# EAGLE board cs_v2.1 (EAGLE 9.6.1)
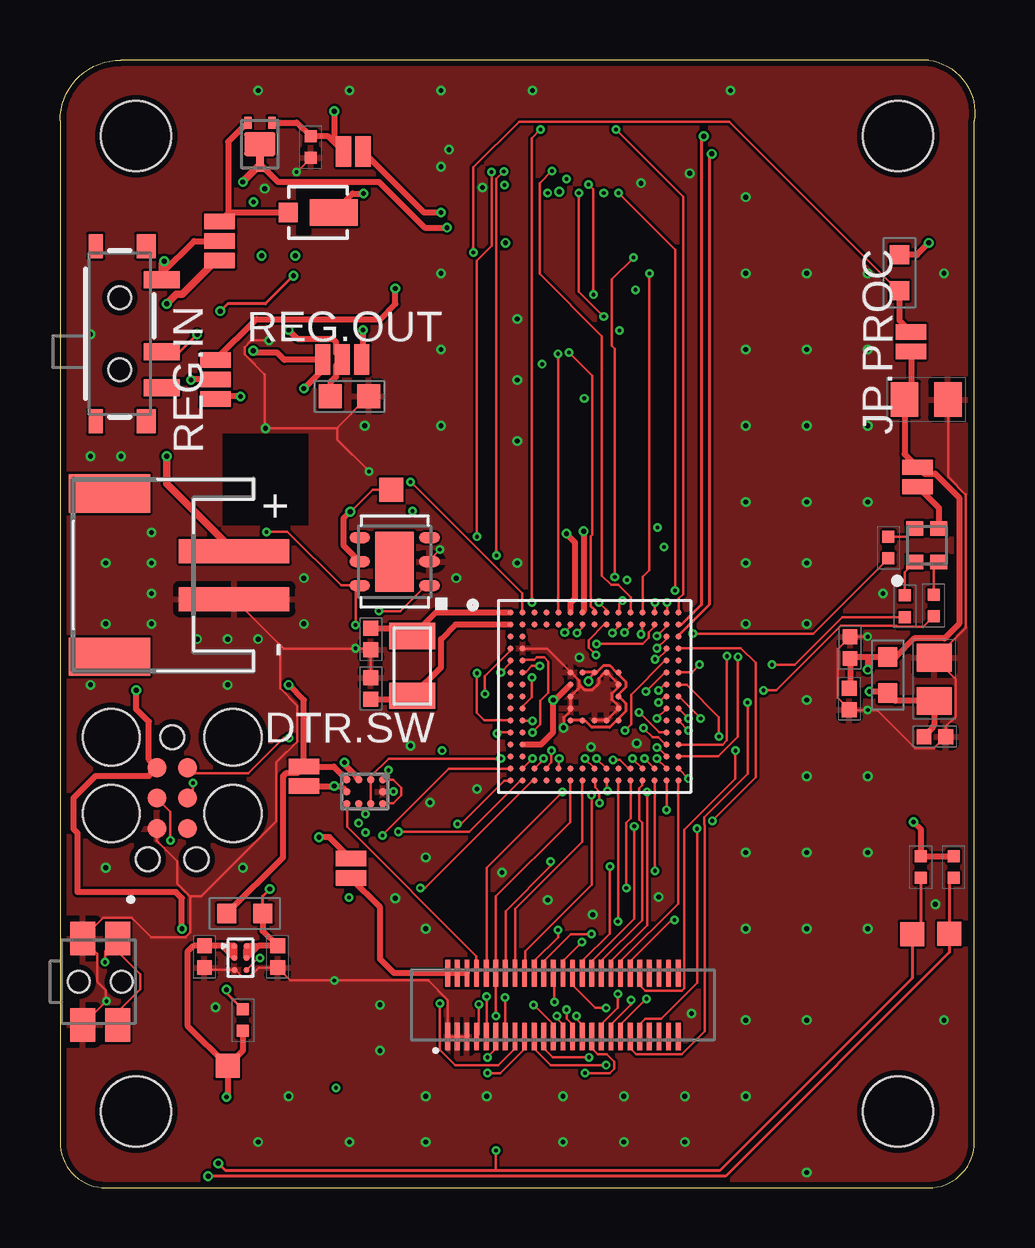
[diagram p11: board, top side]
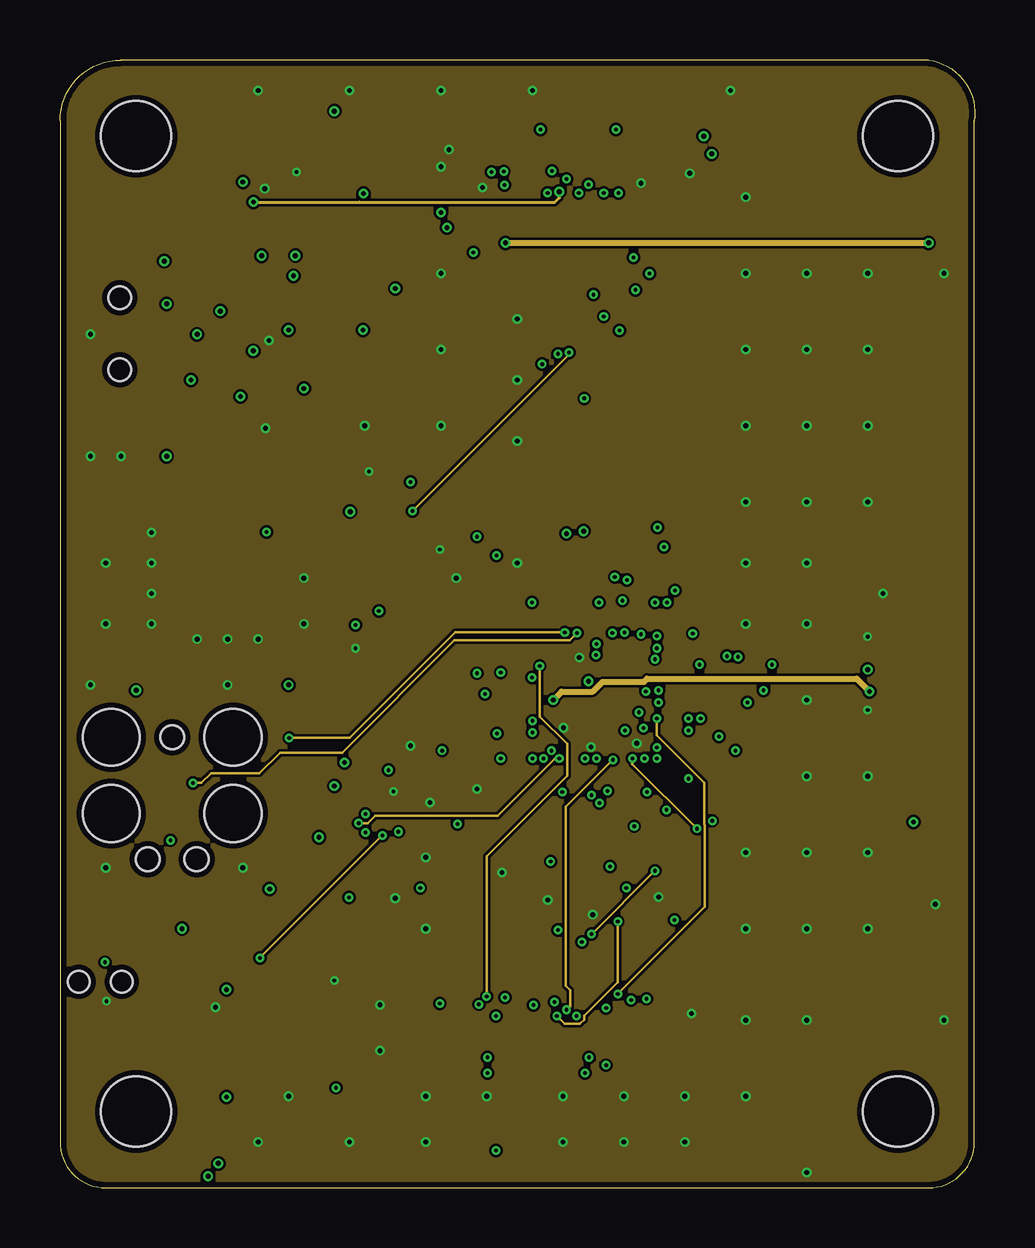
[diagram p12: board, inner layer Route2]
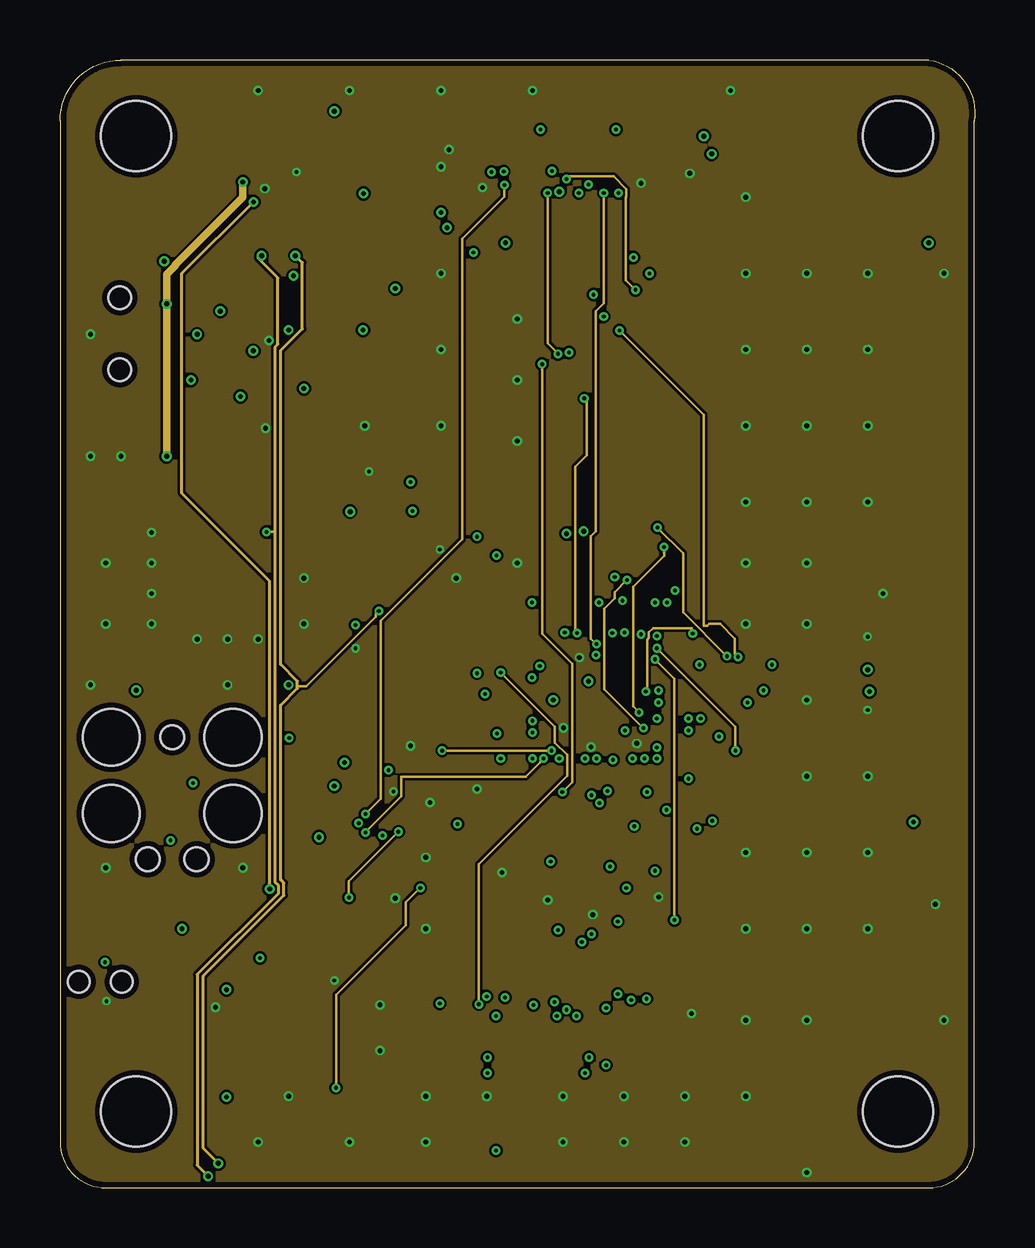
[diagram p13: board, inner layer Route15]
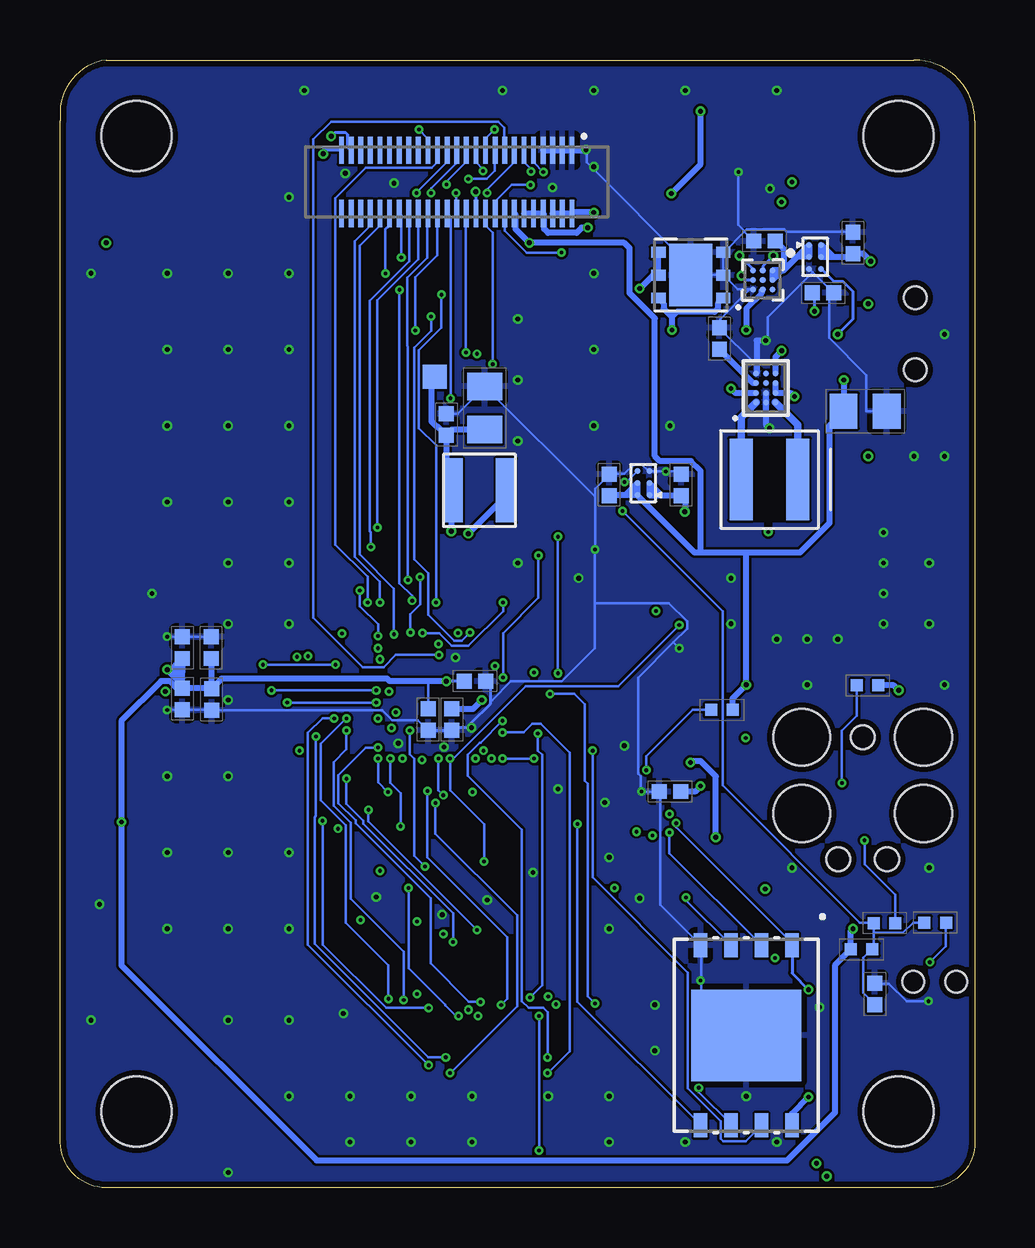
[diagram p14: board, bottom side, seen from below]

Size 38.12 x 46.99 mm. Coordinates in mm from the lower left corner, seen from the top.
Outline: 1.91,0 36.2,0 arc90 38.1,1.91 38.1,44.45 arc90 36.2,46.99 2.54,46.99 arc90 0,44.45 0,1.91 arc90 1.91,0
Copper layers (1+2*15+16): Top 0.001778125mm / dielectric 0.231140625mm / Route2 0.01778125mm / dielectric 0.929640625mm / Route15 0.01778125mm / dielectric 0.231140625mm / Bottom 0.01778125mm
Design rules "CSv2_bittele_4-layer *": minimum track width 4mil, minimum drill 6mil, track to track 4mil, track to pad 4mil, pad to pad 4mil, via to via 4mil, smd to smd 4mil, copper to edge 10mil, drill to drill 5mil, minimum pad ring 4mil, minimum via ring 4mil, stop-mask expansion 4mil, vias tented up to drill 0.25mm, thermal gap 10mil
Net classes: 1 power_3v3: width 0.254 mm; 5 10_mil: width 0.254 mm
Holes 2.92 mm at 3.17,3.17 34.92,3.17 34.92,43.81 3.17,43.81

## Footprints (pad centres in the part's own frame; a part is rotated, then mirrored left to right if it is on the bottom)
C0402 = smd 0.62 x 0.62: 1 -0.45,0; 2 0.45,0
C0805 = smd 1.15 x 1.45: 1 -0.9,0; 2 0.9,0
C0603 = smd 0.95 x 1: 1 -0.8,0; 2 0.8,0
TP10SQ = smd 1 x 1: TP 0,0
DIALIGHT_0606_598-8710-307F_0 = smd 0.6 x 0.7: 1 -0.7,0.5; 2 0.7,0.5; 3 -0.7,-0.5; 4 0.7,-0.5
SMT-JUMPER_2_NC_PASTE_NO-SILK = smd 0.635 x 1.27: 1 -0.406,0; 2 0.406,0
8.06.16_6-PIN_NEEDLE_ADAPTER_LEGS = smd 0.787 x 0.787: 1 -1.27,-0.635; 2 -1.27,0.635; 3 0,-0.635; 4 0,0.635; 5 1.27,-0.635; 6 1.27,0.635 | hole 0.991: -2.54,0; 2.54,1.015; 2.54,-1.015 | hole 2.375: -2.54,2.54; 0.635,2.54; 0.635,-2.54; -2.54,-2.54
JST-PH-2-SMT-RA = smd 1 x 4.6: 1 1,-3.7; 2 -1,-3.7 | smd 1.6 x 3.4: NC1 -3.4,1.5; NC2 3.4,1.5
HRS_DF40HC(4.0)-50DS-0.4V(51) = smd 0.2 x 1.14: 1 -4.8,-1.32; 2 -4.8,1.32; 3 -4.4,-1.32; 4 -4.4,1.32; 5 -4,-1.32; 6 -4,1.32; 7 -3.6,-1.32; 8 -3.6,1.32; 9 -3.2,-1.32; 10 -3.2,1.32; 11 -2.8,-1.32; 12 -2.8,1.32; 13 -2.4,-1.32; 14 -2.4,1.32; 15 -2,-1.32; 16 -2,1.32; 17 -1.6,-1.32; 18 -1.6,1.32; 19 -1.2,-1.32; 20 -1.2,1.32; 21 -0.8,-1.32; 22 -0.8,1.32; 23 -0.4,-1.32; 24 -0.4,1.32; 25 0,-1.32; 26 0,1.32; 27 0.4,-1.32; 28 0.4,1.32; 29 0.8,-1.32; 30 0.8,1.32; 31 1.2,-1.32; 32 1.2,1.32; 33 1.6,-1.32; 34 1.6,1.32; 35 2,-1.32; 36 2,1.32; 37 2.4,-1.32; 38 2.4,1.32; 39 2.8,-1.32; 40 2.8,1.32; 41 3.2,-1.32; 42 3.2,1.32; 43 3.6,-1.32; 44 3.6,1.32; 45 4,-1.32; 46 4,1.32; 47 4.4,-1.32; 48 4.4,1.32; 49 4.8,-1.32; 50 4.8,1.32
SMT-JUMPER_3_1-NC_PASTE_NO-SILK = smd 0.635 x 1.27: 1 -0.813,0; 2 0,0; 3 0.813,0
L1212 = smd 0.813 x 2.667: P$1 -1.1,0; P$2 1.1,0
L0603 = smd 0.8 x 0.8: 1 -0.75,0; 2 0.75,0
XAL40 = smd 0.965 x 3.404: 1 1.181,0; 2 -1.181,0
X2-DFN2015-3 = smd 0.309 x 0.5: 1 -0.5,-0.9; 2 0.5,-0.9 | smd 1.3 x 1: 3-1 0,0 | smd 0.309 x 0.65: 3-2 0,0.825
R0402 = smd 0.5 x 0.5: 1 -0.45,0; 2 0.45,0
R0603 = smd 0.8 x 0.8: 1 -0.75,0; 2 0.75,0
SW_EVQ-P7L01P = smd 1.4 x 1.05: 1_1 -1.8,0.725; 1_2 1.8,0.725; 2_1 -1.8,-0.725; 2_2 1.8,-0.725 | hole 0.9: 0,-0.9; 0,0.9
SWITCH_SPST_SMD_A = smd 0.7 x 1.5: 1 -2.25,-1.75; 2 -0.75,-1.75; 3 2.25,-1.75 | smd 1 x 0.6: GND1 -3.65,1; GND3 3.65,1 | smd 1 x 0.8: GND2 -3.65,-1.1; GND4 3.65,-1.1 | hole 0.95: -1.5,0; 1.5,0
UDFN6_NCP708] = smd 0.6 x 0.45: 1 -1.35,0.95; 2 -1.35,0; 3 -1.35,-0.95; 4 1.35,-0.95; 5 1.35,0; 6 1.35,0.95 | smd 1.8 x 2.6: 7 0,0
WSON-8_W15N = smd 1 x 0.55: 1 -3.746,1.905; 2 -3.746,0.635; 3 -3.746,-0.635; 4 -3.746,-1.905; 5 3.746,-1.905; 6 3.746,-0.635; 7 3.746,0.635; 8 3.746,1.905 | smd 3.81 x 4.572: 9 0,0
DSBGA10 = smd 0.305 x 0.305: A1 -0.5,0.75; A2 0,0.75; A3 0.5,0.75; B1 -0.5,0.25; B3 0.5,0.25; C1 -0.5,-0.25; C3 0.5,-0.25; D1 -0.5,-0.75; D2 0,-0.75; D3 0.5,-0.75
WLCSP6_2X3 = smd 0.254 x 0.254: A1 -0.25,0.5; A2 0.25,0.5; B1 -0.25,0; B2 0.25,0; C1 -0.25,-0.5; C2 0.25,-0.5
POWERDI323 = smd 2 x 1.1: 1 -1.25,0 | smd 0.8 x 0.8: 2 0.65,0
TFBGA120 = smd 0.25 x 0.25: GNDANA0 -1,0; GNDIO0 -3,2; GNDIO1 -1,-0.5; GNDIO2 0,-1; GNDIO3 0.5,-1; GNDIO4 1,-0.5; GNDIO5 1,0.5; GNDIO6 0.5,1; GNDIO7 -1,1; NRESET 0,3.5; PA00 -3.5,3.5; PA01 -3.5,3; PA02 -3.5,1.5; PA03 -3,1; PA04 -3,-1; PA05 -3.5,-1.5; PA06 -3,-1.5; PA07 -3.5,-2; PA08 -3.5,-3.5; PA09 -2.5,-3; PA10 -3,-3.5; PA11 -2,-3; PA12 2,-3.5; PA13 2.5,-3; PA14 2.5,-3.5; PA15 3,-3.5; PA16 3.5,-3.5; PA17 3,-3; PA18 3.5,-3; PA19 3,-2.5; PA20 3,1.5; PA21 3.5,2; PA22 3,2; PA23 3,2.5; PA24 3.5,2.5; PA25 3.5,3; PA27 0,3; PA30 -0.5,3; PA31 -1,3; PB00 -2.5,3.5; PB01 -2.5,3; PB02 -3,3.5; PB03 -3,3; PB04 -3.5,1; PB05 -3.5,0.5; PB06 -3,0; PB07 -3.5,-0.5; PB08 -3,-0.5; PB09 -3.5,-1; PB10 -2.5,-3.5; PB11 -1.5,-3; PB12 -2,-3.5; PB13 -1,-3; PB14 -1.5,-3.5; PB15 -0.5,-3; PB16 3.5,0; PB17 3.5,0.5; PB18 3,0.5; PB19 3.5,1; PB20 3,1; PB21 3.5,1.5; PB22 3.5,3.5; PB23 3,3.5; PB24 3,3; PB25 2.5,3; PB26 2.5,3.5; PB27 2,3; PB28 2,3.5; PB29 1.5,3; PB30 -1.5,3.5; PB31 -1.5,3; PC00 -3.5,2.5; PC01 -3,2.5; PC02 -3.5,2; PC03 -3,1.5; PC04 -3.5,-2.5; PC05 -3,-2.5; PC06 -3.5,-3; PC07 -3,-3; PC10 1,-3; PC11 0.5,-3.5; PC12 1,-3.5; PC13 1.5,-3; PC14 1.5,-3.5; PC15 2,-3; PC16 3.5,-2.5; PC17 3,-2; PC18 3.5,-2; PC19 3,-1.5; PC20 3.5,-1.5; PC21 3,-1; PC22 3.5,-1; PC23 3,-0.5; PC24 1.5,3.5; PC25 1,3; PC26 1,3.5; PC27 0.5,3.5; PC28 0.5,3; PC30 -2,3.5; PC31 -2,3; PD00 -3,0.5; PD01 -3.5,0; PD08 -1,-3.5; PD09 0,-3; PD10 -0.5,-3.5; PD11 0.5,-3; PD12 0,-3.5; PD20 3.5,-0.5; PD21 3,0; VDDANA0 -1,0.5; VDDANA1 -3,-2; VDDCORE -0.5,3.5; VDDIO3 1,-1; VDDIO4 1,0; VDDIO5 1,1; VDDIO6 0,1; VDDIO7 -0.5,1; VDDIOB1 -1,-1; VDDIOB2 -0.5,-1; VSW -1,3.5
BGA9N40P3X3_144X146X69N = smd 0.24 x 0.24: A1 -0.4,0.4; A2 0,0.4; A3 0.4,0.4; B1 -0.4,0; B2 0,0; B3 0.4,0; C1 -0.4,-0.4; C2 0,-0.4; C3 0.4,-0.4
12-WLP = smd 0.244 x 0.244: A1 -0.6,0.4; A2 -0.2,0.4; A3 0.2,0.4; A4 0.6,0.4; B1 -0.6,0; B2 -0.2,0; B3 0.2,0; B4 0.6,0; C1 -0.6,-0.4; C2 -0.2,-0.4; C3 0.2,-0.4; C4 0.6,-0.4
DFN-06 = smd 0.85 x 0.45: 1 -1.45,1; 2 -1.45,0; 3 -1.45,-1; 4 1.45,-1; 5 1.45,0; 6 1.45,1 | smd 1.6 x 2.5: 7 0,0
XTAL320X150X90 = smd 1.092 x 1.905: 1 -1.245,0; 2 1.245,0

## Placement (x,y rotation side)
C1  0.1u  [C0402]  12.7,16.51 180 bottom
C2  1u  [C0402]  5.08,39.37 90 bottom
C101  0.1u  [C0402]  4.17,8.08 90 bottom
C102  0.1u  [C0402]  32.92,22.5 90 top
C103  0.1u  [C0402]  22.02,31.8 90 bottom
C104  0.1u  [C0402]  33.02,22.5 90 bottom
C105  0.1u  [C0402]  21.79,19.51 270 bottom
C106  0.1u  [C0402]  33.02,20.37 270 bottom
C107  4.7u  [C0805]  20.42,32.49 90 bottom
C108  0.1u  [C0402]  36.45,18.8 0 top
C109  0.1u  [C0402]  32.89,20.37 270 top
C110  10u  [C0805]  36.42,21.18 90 top
C111  0.1u  [C0402]  22.78,19.51 270 bottom
C112  0.1u  [C0402]  31.8,20.35 270 bottom
C113  0.1u  [C0402]  20.83,21.11 0 bottom
C114  1u  [C0402]  31.83,22.5 90 bottom
C115  10u  [C0805]  36.09,32.84 0 top
C118  10p  [C0402]  12.95,22.86 270 top
C119  10p  [C0402]  12.95,20.8 90 top
C201  100n  [C0402]  8.76,39.45 180 bottom
C202  10u  [C0603]  12.06,32.97 0 top
C203  470n  [C0402]  6.32,37.29 0 bottom
C204  1u  [C0402]  10.64,35.38 90 bottom
C205  22u  [C0805]  4.57,32.36 0 bottom
C206  1u  [C0402]  9.07,9.63 270 top
C207  1u  [C0402]  15.24,29.29 90 bottom
C208  0.1u  [C0402]  6.02,9.63 270 top
C209  0.1u  [C0402]  12.24,29.29 90 bottom
CPU  PTR1TP10SQ  [TP10SQ]  22.5,33.78 180 bottom
D202  DIALIGHT_RGBLED_598-8710-307FDIALIGHT_598-8710-307F_0_0  [DIALIGHT_0606_598-8710-307F_0]  36.12,26.77 90 top
DTR.SW  JUMPER-SMT_2_NC_PASTE_NO-SILK  [SMT-JUMPER_2_NC_PASTE_NO-SILK]  10.16,17.14 90 top
J101  J-JTAG-CORTEX-NEEDLE6-LEGS  [8.06.16_6-PIN_NEEDLE_ADAPTER_LEGS]  4.67,16.23 270 top
J201  [JST-PH-2-SMT-RA]  3.56,25.53 90 top
J301  HIROSE-DF40_50-PIN_CONNECTORS-RECEPTACLE  [HRS_DF40HC(4.0)-50DS-0.4V(51)]  20.95,7.62 0 top
J302  HIROSE-DF40_50-PIN_CONNECTORS-RECEPTACLE  [HRS_DF40HC(4.0)-50DS-0.4V(51)]  21.59,41.91 180 bottom
JP201  JUMPER-SMT_2_NC_PASTE_NO-SILK  [SMT-JUMPER_2_NC_PASTE_NO-SILK]  12.22,43.18 0 top
JP202  JUMPER-SMT_2_NC_PASTE_NO-SILK  [SMT-JUMPER_2_NC_PASTE_NO-SILK]  35.74,29.62 90 top
JP203  JUMPER-SMT_3_1-NC_PASTE_NO-SILK  [SMT-JUMPER_3_1-NC_PASTE_NO-SILK]  6.65,39.45 90 top
JP205  JUMPER-SMT_2_NC_PASTE_NO-SILK  [SMT-JUMPER_2_NC_PASTE_NO-SILK]  12.12,13.31 90 top
JP.PROC  JUMPER-SMT_2_NC_PASTE_NO-SILK  [SMT-JUMPER_2_NC_PASTE_NO-SILK]  35.46,35.26 90 top
L101  L1212  [L1212]  20.65,29.06 180 bottom
L102  L0603  [L0603]  34.49,21.36 90 top
L201  1u  [XAL40]  8.56,29.51 0 bottom
Q1  DMG3415UFY4Q-7F  [X2-DFN2015-3]  8.33,43.48 180 top
R1  510k  [R0402]  10.44,43.36 90 top
R3  100k  [R0402]  7.62,6.99 90 top
R101  10k  [R0402]  4.72,9.93 180 bottom
R102  330  [R0402]  1.65,11.05 0 bottom
R103  4.7k  [R0402]  37.24,13.36 90 top
R104  4.7k  [R0402]  35.86,13.36 90 top
R105  39  [R0402]  3.76,11.02 0 bottom
R106  1k  [R0402]  4.47,20.93 0 bottom
R202  590  [R0402]  36.4,24.26 270 top
R203  590  [R0402]  35.2,24.23 270 top
R204  1k  [R0402]  34.52,26.67 270 top
R206  2.21  [R0603]  34.98,38.13 270 top
R207  0.24  [R0402]  10.54,19.91 180 bottom
R208  1  [R0603]  7.7,11.43 0 top
REG.IN  JUMPER-SMT_3_1-NC_PASTE_NO-SILK  [SMT-JUMPER_3_1-NC_PASTE_NO-SILK]  6.48,33.68 90 top
REG.OUT  JUMPER-SMT_3_1-NC_PASTE_NO-SILK  [SMT-JUMPER_3_1-NC_PASTE_NO-SILK]  11.76,34.52 0 top
S101  SW_EVQ-P7L01P_SPST_RA  [SW_EVQ-P7L01P]  1.68,8.59 270 top
S201  [SWITCH_SPST_SMD_A]  2.49,35.59 90 top
SCL  PTR1TP10SQ  [TP10SQ]  37.06,10.59 90 top
SDA  PTR1TP10SQ  [TP10SQ]  35.51,10.57 90 top
STOR  PTR1TP10SQ  [TP10SQ]  6.99,5.08 180 top
TEMP  PTR1TP10SQ  [TP10SQ]  13.79,29.08 270 top
U1  NCP708MU330TAG  [UDFN6_NCP708]]  11.84,38.02 180 bottom
U2  W25N01GVZEIG  [WSON-8_W15N]  9.53,6.35 270 bottom
U3  TS3A24159YZPR  [DSBGA10]  12.7,16.51 270 top
U4  LOADSWITCH-MIC94164  [WLCSP6_2X3]  6.65,38.79 0 bottom
U5  PD3S140-7  [POWERDI323]  10.16,40.64 180 top
U101  ATSAMD51  [TFBGA120]  22.28,20.47 0 top
U201  COULOMB-MAX17262  [BGA9N40P3X3_144X146X69N]  8.84,37.82 270 bottom
U202  MAX77827BEWC+T  [12-WLP]  8.71,33.32 90 bottom
U203  SENSOR-SI7006  [DFN-06]  13.94,26.09 180 top
U204  LOADSWITCH-MIC94164  [WLCSP6_2X3]  7.52,9.58 0 top
U205  LOADSWITCH-MIC94164  [WLCSP6_2X3]  13.82,29.36 180 bottom
Y102  ABS07-32.768KHZ-9-T  [XTAL320X150X90]  14.68,21.74 270 top

## Tracks (layer width: path | path; a pad name or v marks a point on that pad's centre or on a via)
+3V3  (via drill 0.2)
  Top 0.254: REG.IN.2 5.49,33.68 v5.46,33.66 | v36.2,39.37 35.7,38.88 R206.1 | DTR.SW.2 11.41,17.55 U3.D1 | DTR.SW.2 9.89,17.29 9.43,17.29 9.3,17.15 9.3,13.78 R208.1 | DTR.SW.2 10.16,20.32 v9.53,20.95
  Route2 0.254: v18.56,39.37 v36.2,39.37
  Bottom 0.254: v5.46,33.66 5.47,33.64 C205.1 6.06,31.77 6.06,27.69 7.29,26.47 9.53,26.47 | U205.A2 14.28,28.86 | 14.28,28.86 14.57,28.86 | 14.57,28.86 15.21,28.86 C207.1 | U205.B2 U205.A2 | U205.B2 14.57,28.86 | U205.B2 14.28,29.16 14.28,28.86 | J302.14 19.15,40.55 19.15,39.95 v18.56,39.37 14.61,39.37 14.4,39.16 14.4,37.29 13.34,36.22 13.34,30.48 13.13,30.27 11.84,30.27 11.43,29.87 11.43,26.47 | U205.A2 13.92,28.72 13.92,28.71 11.68,26.47 11.43,26.47 | 9.53,26.47 11.43,26.47 | 9.53,26.47 v9.53,20.95 10.09,20.39 R207.1
+3V3_DTR
  Top 0.254: J301.6 J301.4 J301.2 13.92,8.94 13.34,9.53 13.34,11.68 JP205.1
+3V3_DTR.SW  (via drill 0.2)
  Top 0.254: JP205.2 11.23,14.61 v10.79,14.61 | U3.C1 12.33,17.13 12.33,17.17 11.85,17.65 v11.85,17.72
  Bottom 0.254: v10.79,14.61 10.79,17.14 11.43,17.78 11.79,17.78 v11.85,17.72
+3V3_DTR_SENSE-  (via drill 0.15)
  Top 0.102: 13.69,16.99 13.46,16.99 U3.A1 | 13.69,16.99 13.89,16.99 14.22,16.66 14.22,16.36 13.89,16.03 13.46,16.03 U3.A3 | 13.69,16.99 v13.69,17.4
  Bottom 0.102: R207.2 11.76,19.91 13.69,17.98 v13.69,17.4
+3V3_PROC  (via drill 0.2)
  Top 0.127: v22.02,21.11 22.02,21.22 U101.VDDIO6 | U101.VDDIO6 U101.VDDIO7 | U101.VDDIO6 22.37,21.47 22.66,21.76 22.9,21.76 23.19,21.47 U101.VDDIO5 23.28,21.39 23.57,21.09 23.57,20.85 23.28,20.56 U101.VDDIO4 23.57,20.18 23.57,19.85 23.28,19.56 U101.VDDIO3 23.19,19.47 22.9,19.18 22.16,19.18 21.87,19.47 U101.VDDIOB2 U101.VDDIOB1
  Top 0.254: JP.PROC.1 35.46,33.11 C115.1 35.19,30.57 JP202.2 36.01,29.76 36.47,29.76 37.47,28.76 37.47,23.5 36.86,22.89 35.6,22.89 34.83,22.11 L102.2 33.66,22.11 | 33.66,22.11 32.98,22.11 C102.1 32.92,20.85 C109.1 | 33.66,22.11 v33.66,21.59 | v35.56,15.24 35.87,14.94 R104.2 R103.2 | v5.08,10.79 5.08,12.06 4.83,12.32 0.74,12.32 0.74,14.77 0.56,14.95 0.56,16.25 1.48,17.16 3.7,17.16 J101.1 3.7,17.84 3.7,19.42 3.17,19.95 v3.17,20.73 | U101.VDDIO5 | U101.VDDIO5 | U101.VDDIO3
  Bottom 0.102: 22.78,21.11 C111.1
  Bottom 0.127: C113.1 v22.02,21.11
  Bottom 0.254: C104.1 33.3,21.77 33.02,21.49 | C104.1 33.02,21.49 | C106.1 33.02,21.01 | 33.02,21.01 33.02,21.23 | 33.02,21.23 33.02,21.49 | C104.1 33.48,21.59 v33.66,21.59 | v33.66,21.59 33.55,21.49 33.02,21.49 | v33.66,21.59 33.07,21.01 33.02,21.01 | v33.66,21.59 33.3,21.23 33.02,21.23 | C106.1 33.27,20.82 33.55,21.11 33.91,21.11 35.56,19.45 v35.56,15.24 35.56,9.27 27.43,1.14 7.82,1.14 5.83,3.13 5.83,9.27 R101.2 5.17,10.7 v5.08,10.79 | v3.17,20.73 3.38,20.93 R106.2 | 22.78,19.99 C111.1 | v22.02,21.11 22.78,21.11 24.38,21.11 24.49,21.21 31.39,21.21 C112.1 31.83,20.82 | C114.1 31.83,20.82 | 31.83,20.82 C106.1
+3V3_STOR  (via drill 0.2)
  Top 0.254: U204.A1 U204.B1 6.99,9.86 | 6.99,9.86 6.77,10.08 6.48,10.08 | 6.48,10.08 C208.1 5.55,10.08 5.31,9.83 5.31,6.76 STOR.TP | U204.A1 6.48,10.08 | U204.A1 7.05,9.86 6.99,9.86 | STOR.TP 6.99,3.83 v6.93,3.79 | R3.1 7.62,5.71 STOR.TP
  Bottom 0.254: U2.8 7.62,3.1 v6.93,3.79
+3V3_TEMP  (via drill 0.2)
  Top 0.102: TEMP.TP 13.03,29.08 12.19,28.25 v12.09,28.17
  Top 0.254: v12.09,28.17 11.81,27.89 11.81,26.77 U203.5
  Bottom 0.254: 13.18,28.86 U205.A1 U205.B1 | 13.18,28.86 13.07,28.86 | 13.07,28.86 12.27,28.86 C209.1 12.06,28.66 12.06,28.17 v12.09,28.17 | U205.B1 13.57,29.25 13.18,28.86 | U205.B1 13.07,28.86
+3V7_BATT  (via drill 0.2)
  Top 0.254: v16.13,40.01 15.19,40.01 13.28,41.91 9.08,41.91 Q1.3-2 Q1.3-1
  Top 0.305: J201.1 4.45,29.34 v4.45,30.48 | v7.62,41.91 8.33,42.62 Q1.3-2 | v4.45,36.83 4.85,37.23 5.09,37.23 6.5,38.63 JP203.1
  Route15 0.305: v7.62,41.91 7.62,41.27 4.8,38.45 4.8,38.42 4.45,38.06 v4.45,36.83 v4.45,30.48
  Bottom 0.254: v16.13,40.01 16.38,40.01 16.59,39.79 17.79,39.79 17.95,39.95 17.95,40.55 J302.8 J302.10 J302.12
BB_LX1
  Bottom 0.305: U202.A1 9.74,32.1 L201.2
BB_LX2
  Bottom 0.305: U202.C1 7.38,31.79 L201.1
BB_REG_OUT  (via drill 0.2)
  Top 0.254: v7.52,32.97 6.58,32.97 REG.IN.1
  Bottom 0.254: v7.52,32.97 7.67,33.12 U202.C2 U202.C3
CC_IN
  Bottom 0.254: 7.14,38.79 U4.B1 U4.A1 | 7.14,38.79 7.41,38.79 | U4.A1 7.14,39.05 7.14,38.79 | U4.A1 7.41,38.79 | 7.41,38.79 7.97,38.22 | 8.04,38.22 8.26,38.22 | 8.26,38.22 U201.A1 U201.A2 | C201.1 7.97,39.1 7.97,38.22 | U201.A2 8.26,38.01 8.26,38.22 | U201.A2 8.04,38.22 | 8.04,38.22 7.97,38.22
DBG_DTR0_V_SENSE  (via drill 0.15)
  Top 0.102: v12.72,15.57 12.47,15.82 12.47,16 U3.C3
  Route15 0.102: v12.72,15.57 13.36,16.2 13.36,23.62 16.76,27.03 16.76,39.55 18.52,41.3 v18.52,41.78
  Bottom 0.102: v18.52,41.78 19.3,41.78 19.99,41.1 19.99,40.62 J302.18
DBG_DTR1_V_SENSE  (via drill 0.15)
  Top 0.102: v20.93,16.48 17.78,13.34 17.78,8.94 J301.10
  Route15 0.102: v20.93,16.48 21.34,16.89 21.34,21.84 20.09,23.09 v20.09,34.31
  Bottom 0.102: v20.09,34.31 20.09,39.8 20.37,40.08 20.37,40.59 J302.20
DBG_GPIO0  (via drill 0.15)
  Top 0.102: v23.16,44.09 25.96,41.3 25.96,24.74 25.78,24.56 U101.PB22
  Bottom 0.102: v23.16,44.09 22.81,43.74 22.81,43.23 J302.31
DBG_GPIO1  (via drill 0.15)
  Top 0.102: v25.3,24.38 25.3,23.98 U101.PB23
  Bottom 0.102: v25.3,24.38 25.3,25.45 26.64,26.8 26.64,41.22 25.38,42.49 22.63,42.49 22.4,42.72 22.4,43.2 J302.29
DBG_GPIO2  (via drill 0.15)
  Top 0.102: v24.87,22.99 25.27,23.39 U101.PB24 | v25.63,24.89 25.63,39.09 v23.27,41.45
  Bottom 0.102: v24.87,22.99 24.87,23.47 25.63,24.23 v25.63,24.89 | v23.27,41.45 22,42.72 22,43.2 J302.27
DBG_GPIO3  (via drill 0.15)
  Top 0.102: v22.35,22.66 24.28,22.66 24.54,22.91 24.54,23.14 24.77,23.37 24.77,23.47 U101.PB25
  Route15 0.102: v22.35,22.66 22.12,22.89 22.12,27.15 22.33,27.36 22.33,36.52 22.66,36.85 v22.66,41.45
  Bottom 0.102: v22.66,41.45 22.66,41.66 21.61,42.7 21.61,43.2 J302.25
DBG_GPIO4/SERCOM6_P0  (via drill 0.15)
  Top 0.102: v28.25,22.12 28.25,18.8 27.43,17.98 25.78,17.98 U101.PC16
  Route15 0.102: v28.25,22.12 28.12,22.25 28.12,22.89 27.51,23.5 27.05,23.5 26.98,23.42 26.82,23.42 26.82,32.21 v23.32,35.71
  Bottom 0.102: v23.32,35.71 23.32,37.95 22.4,38.86 22.4,40.59 J302.30
DBG_GPIO5/SERCOM6_P1  (via drill 0.15)
  Top 0.102: v24.31,19.15 24.69,18.77 24.92,18.77 25.2,18.49 25.27,18.49 U101.PC17
  Route15 0.102: v24.31,19.15 22.68,20.78 22.68,24.13 23.11,24.56 23.11,24.82 v23.62,25.32
  Bottom 0.102: v23.62,25.32 23.62,35.05 23.65,35.08 23.65,37.92 22.81,38.76 22.81,40.59 J302.32
DBG_GPIO6/SERCOM6_P2  (via drill 0.15)
  Top 0.102: v27.79,22.15 27.79,18.64 27.61,18.47 U101.PC18
  Route15 0.102: v27.79,22.15 25.96,23.98 25.96,26.44 v24.89,27.51
  Bottom 0.102: v24.89,27.51 24.89,36.98 23.19,38.68 J302.34
DBG_GPIO7/SERCOM6_P3  (via drill 0.15)
  Top 0.102: v24.13,19.81 24.97,18.97 U101.PC19
  Route15 0.102: v24.13,19.81 23.88,20.07 23.88,25.04 25.17,26.34 v25.17,26.7
  Bottom 0.102: v25.17,26.7 25.17,27.3 25.22,27.36 25.22,36.96 23.57,38.61 23.57,40.59 J302.36
DBG_GPIO8  (via drill 0.15)
  Top 0.102: v24.79,24.38 U101.PB26
  Bottom 0.102: v24.79,24.38 24.79,25.25 25.83,26.29 25.83,39.45 25.2,40.08 J302.44
DBG_GPIO9  (via drill 0.15)
  Top 0.102: v24.21,23.06 24.26,23.11 24.26,23.47 U101.PB27
  Bottom 0.102: v24.21,23.06 24.21,24.97 25.63,26.39 25.63,39.24 24.79,40.08 J302.42
DBG_GPIO10  (via drill 0.15)
  Top 0.102: v24.56,38.1 24.56,25.73 24.28,25.45 U101.PB28
  Bottom 0.102: v24.56,38.1 24.56,39.93 24.41,40.08 24.41,40.59 J302.40
DBG_GPIO11  (via drill 0.15)
  Top 0.102: v23.52,23.14 23.77,23.39 U101.PB29 | v23.11,25.45 23.11,34.95 22.99,35.08 22.99,37.85 v23.9,38.76
  Bottom 0.102: v23.52,23.14 23.52,23.9 23.11,24.31 v23.11,25.45 | v23.9,38.76 23.9,40.51 23.98,40.59 J302.38
DBG_PROC_V_SENSE  (via drill 0.15)
  Top 0.102: v17.22,38.96 17.22,42.52 19.13,44.42 27.89,44.42 34.87,37.44 R206.2
  Top 0.254: R206.2 34.98,36.14 JP.PROC.2
  Bottom 0.102: v17.22,38.96 18.67,38.96 19.58,39.88 J302.16
DBG_SERIAL_RX_SERCOM4  (via drill 0.15)
  Top 0.102: v17.37,21.44 17.37,19.79 17.68,19.48 18.77,19.48 U101.PB09 | v17.37,27.13 17.37,38.63 17.98,39.24 v17.98,42.32
  Bottom 0.102: v17.37,27.13 v17.37,21.44 | v17.98,42.32 18.39,42.72 18.39,43.2 J302.9
DBG_SERIAL_TX_SERCOM4  (via drill 0.15)
  Top 0.102: v19.66,21.26 19.66,20.45 19.28,20.07 19.28,19.99 U101.PB08 | v18.19,26.34 18.19,42.04 v18.49,42.34
  Bottom 0.102: v19.66,21.26 19.66,23.11 18.19,24.59 v18.19,26.34 | v18.49,42.34 18.49,42.44 18.77,42.72 18.77,43.2 J302.11
DBG_STOR_V_SENSE  (via drill 0.2)
  Top 0.127: R208.2 8.45,12.15 v8.74,12.45
  Top 0.254: R208.2 8.45,10.7 C206.1 8.26,10.08 | 7.9,10.08 U204.A2 7.77,9.8 | 7.9,10.08 8.26,10.08 | 7.77,9.8 U204.B2 | U204.B2 7.98,9.8 | 8.26,10.08 7.98,9.8 | 7.98,9.8 7.77,9.8 | U204.B2 7.77,9.95 7.9,10.08
  Route2 0.127: v8.06,41.07 12.49,41.07 12.5,41.06 20.61,41.06 20.8,41.25 v20.8,41.5
  Route15 0.127: v8.74,12.45 8.74,25.27 5.08,28.93 5.08,38.1 v8.05,41.07 v8.06,41.07
  Bottom 0.127: J302.22 20.8,40.6 v20.8,41.5
DBG_SWCLK  (via drill 0.15)
  Top 0.102: v5.54,16.87 5.54,16.46 J101.4 | v21.54,23.11 21.77,23.34 21.77,23.47 U101.PA30
  Route2 0.102: v5.54,16.87 5.89,16.87 6.3,17.27 8.31,17.27 9.17,18.14 11.76,18.14 16.43,22.81 21.23,22.81 v21.54,23.11
  Route15 0.102: v21.54,23.11 21.46,23.19 21.46,30.05 21.95,30.53 21.95,32.79 v21.84,32.89
  Bottom 0.102: v5.54,16.87 5.54,19.05 4.93,19.66 R106.1 | v21.84,32.89 21.84,40.46 21.97,40.59 J302.28
DBG_SWDIO  (via drill 0.15)
  Top 0.102: v21.03,23.14 21.26,23.37 21.26,23.47 U101.PA31 | v9.55,18.75 9.32,18.75 7.85,17.27 5.54,17.27 J101.2 | v21.61,41.45 21.61,37.34 v22.66,36.3
  Route2 0.102: v21.03,23.14 16.46,23.14 12.06,18.75 v9.55,18.75
  Bottom 0.102: v21.61,41.45 21.61,40.62 J302.26 | v22.66,36.3 22.66,35.71 23.37,35 23.37,26.19 22.78,25.6 22.78,23.88 21.69,22.78 21.39,22.78 v21.03,23.14
DBG_TRACE_CLK/GPIO17  (via drill 0.15)
  Top 0.102: v22.45,24.38 22.76,24.08 22.76,23.98 U101.PC27 | v22.23,37.21 22.23,41.6 v22.02,41.81
  Bottom 0.102: v22.45,24.38 22.45,30.94 23.16,31.65 23.16,34.9 22.23,35.84 v22.23,37.21 | v22.02,41.81 22.02,41.91 21.21,42.72 21.21,43.2 J302.23
DBG_TRACE_D0/GPIO13  (via drill 0.15)
  Top 0.102: v22.33,22.2 22.02,22.5 22.02,22.81 22.68,23.47 22.76,23.47 U101.PC28
  Bottom 0.102: v22.33,22.2 24.13,22.2 24.64,21.69 25.5,21.69 27.56,23.75 27.56,43.69 26.82,44.42 19.86,44.42 19.61,44.17 19.61,43.23 J302.15
DBG_TRACE_D1/GPIO14  (via drill 0.15)
  Top 0.102: v23.44,24.46 23.29,24.31 23.29,23.98 U101.PC26
  Route15 0.102: v23.98,37.41 23.57,37.82 23.57,41.27 23.6,41.3 23.6,41.6 23.06,42.14 21.11,42.14 v21.11,42.04
  Bottom 0.102: v23.44,24.46 23.44,24.66 23.98,25.2 v23.98,37.41 | v21.11,42.04 20.34,42.04 20.02,42.37 20.02,43.2 J302.17
DBG_TRACE_D2/GPIO15  (via drill 0.15)
  Top 0.102: v23.01,23.11 23.27,23.37 23.27,23.47 U101.PC25 | v19.66,24.38 19.66,43.74 v20.02,44.09
  Bottom 0.102: v23.01,23.11 22.33,23.11 21.79,22.58 21.11,22.58 19.66,24.03 v19.66,24.38 | v20.02,44.09 20.37,43.74 20.37,43.23 J302.19
DBG_TRACE_D3/GPIO16  (via drill 0.15)
  Top 0.102: v20.5,42.37 19.99,41.86 19.99,38.08 22.58,35.48 22.58,25.5 22.96,25.12 23.27,25.12 23.77,24.61 U101.PC24
  Bottom 0.102: v20.5,42.37 20.5,42.44 20.78,42.72 20.78,43.2 J302.21
DBG_TRACE_SWO/GPIO12  (via drill 0.15)
  Top 0.102: v20.75,34.75 20.75,23.98 U101.PB30
  Route15 0.102: v20.75,34.75 20.32,35.18 v20.32,41.45
  Bottom 0.102: v20.32,41.45 20.32,41.6 19.2,42.72 19.2,43.2 J302.13
DBG_USB_D_N  (via drill 0.2)
  Top 0.127: v27.15,43.08 27.05,42.98 27.05,24.29 25.78,23.02 U101.PA24
  Bottom 0.127: J302.49 27.15,43.23 v27.15,43.08
DBG_USB_D_P  (via drill 0.2)
  Top 0.127: v26.82,43.81 26.72,43.71 26.72,24.29 25.9,23.47 U101.PA25
  Bottom 0.127: J302.47 26.12,43.37 26.12,43.87 26.22,43.97 26.67,43.97 v26.82,43.81
DBG_VDD  (via drill 0.2)
  Top 0.254: JP201.2 15.16,40.64 v15.88,40.64
  Bottom 0.254: v15.88,40.64 16.74,40.64 J302.2 J302.4 J302.6
DTR_BUS0_AIN0/GPIO2  (via drill 0.15)
  Top 0.102: v18.36,21.46 18.77,21.87 U101.PA02 | v17.45,7.64 17.45,6.4 17.37,6.33 J301.7
  Route15 0.102: v18.36,21.46 20.62,19.2 20.62,18.54 21.13,18.03 21.13,17.17 17.45,13.49 v17.45,7.64
DTR_BUS0_AIN1/GPIO3  (via drill 0.15)
  Top 0.102: v19.99,21.74 19.66,21.74 19.41,21.49 19.28,21.49 U101.PA03 | v17.78,7.98 17.78,6.33 J301.9
  Route2 0.102: v19.99,21.74 19.99,19.63 21.13,18.49 21.13,17.17 17.78,13.82 v17.78,7.98
DTR_BUS0_GPIO0/I2S_SCK0  (via drill 0.15)
  Top 0.102: v26.7,19.56 U101.PB16 | v22.76,5.11 20.45,5.11 19.76,5.79 J301.19
  Bottom 0.102: v26.7,19.56 27.18,19.56 27.79,18.95 27.79,10.13 v22.76,5.11
DTR_BUS0_GPIO1/I2S_MCK0  (via drill 0.15)
  Top 0.102: v27.46,18.8 27.46,19.61 26.11,20.95 25.78,20.95 U101.PB17 | v22.05,5.44 20.52,5.44 20.17,5.79 J301.21
  Bottom 0.102: v27.46,18.8 27.46,15.49 27.51,15.44 27.51,10.16 22.78,5.44 v22.05,5.44
DTR_BUS0_SERCOM5_P0/I2S_FS1  (via drill 0.15)
  Top 0.102: v24.87,22.48 25.27,22.89 U101.PA23 | v28.14,18.21 28.14,17.04 26.01,14.91 26.01,8.31 25.91,8.2 24.38,8.2 24.16,8.43 24.16,8.91 J301.42
  Route15 0.102: v24.87,22.48 28.14,19.2 v28.14,18.21
DTR_BUS0_SERCOM5_P1/I2S_SDI  (via drill 0.15)
  Top 0.102: v24.79,22.02 24.89,22.02 25.27,22.4 25.27,22.45 U101.PA22 | v25.6,11.15 25.48,11.15 23.77,9.45 23.77,8.94 J301.40
  Route15 0.102: v24.79,22.02 25.6,21.21 v25.6,11.15
DTR_BUS0_SERCOM5_P2/I2S_FS0  (via drill 0.15)
  Top 0.102: v23.55,19.05 23.8,19.3 23.8,20.55 25.22,21.97 U101.PA20 | v22.91,13.39 22.91,10.59 21.77,9.45 J301.30
  Bottom 0.102: v23.55,19.05 23.55,18.06 23.37,17.88 23.37,13.84 v22.91,13.39
DTR_BUS0_SERCOM5_P3/I2S_SDO  (via drill 0.15)
  Top 0.102: v27.18,15.29 28.98,17.09 28.98,21.87 28.37,22.48 U101.PA21 | v22.76,7.49 22.3,7.49 21.36,8.43 21.36,8.91 J301.28
  Bottom 0.102: v27.18,15.29 27.18,10.13 24.54,7.49 v22.76,7.49
DTR_BUS1_AIN0/GPIO2  (via drill 0.15)
  Top 0.102: v19.68,19.46 19.28,19.46 U101.PA04 | v17.8,5.44 18.14,5.77 18.14,6.3 J301.11
  Bottom 0.102: v19.68,19.46 20.6,18.54 20.62,18.54 21.13,18.03 21.13,17.17 18.87,14.91 18.87,7.77 18.59,7.49 17.98,7.49 17.8,7.32 v17.8,5.44
DTR_BUS1_AIN1/GPIO3  (via drill 0.15)
  Top 0.102: U101.PA05 18.26,18.97 v18.21,18.92 | v18.54,7.92 18.54,6.33 J301.13
  Bottom 0.102: v18.21,18.92 18.21,18.21 18.03,18.03 18.03,8.43 v18.54,7.92
DTR_BUS1_GPIO0  (via drill 0.15)
  Top 0.102: v22.81,16.54 22.78,16.56 U101.PC11 | v19.74,7.62 20.55,6.81 20.55,6.33 J301.23
  Bottom 0.102: v22.81,16.54 22.81,13.77 19.48,10.44 19.48,7.87 v19.74,7.62
DTR_BUS1_GPIO1  (via drill 0.15)
  Top 0.102: v23.24,11.1 23.27,11.12 23.27,16.97 U101.PC12 | v20.7,7.16 20.7,7.06 20.95,6.81 20.95,6.33 J301.25
  Route2 0.102: v23.24,11.1 23.24,8.56 21.84,7.16 21.84,7.01 21.67,6.83 21.03,6.83 v20.7,7.16
DTR_BUS1_SERCOM1_P0
  Top 0.102: U101.PA16 25.76,16.97 25.76,11.84 23.37,9.45 J301.38
DTR_BUS1_SERCOM1_P1  (via drill 0.15)
  Top 0.102: v24.87,17.88 U101.PA17 | v24.46,16.48 24.46,10.95 22.96,9.45 J301.36
  Bottom 0.102: v24.87,17.88 24.87,16.89 v24.46,16.48
DTR_BUS1_SERCOM1_P2  (via drill 0.15)
  Top 0.102: v26.19,17.04 25.78,17.45 U101.PA18 | v21.74,10.24 20.98,9.47 20.98,8.94 J301.26
  Bottom 0.102: v26.19,17.04 26.19,16 25.48,15.29 25.48,15.16 21.74,11.43 v21.74,10.24
DTR_BUS1_SERCOM1_P3  (via drill 0.15)
  Top 0.102: v24.87,18.34 24.92,18.34 25.27,17.98 U101.PA19 | v20.6,7.75 20.6,8.89 20.57,8.91 J301.24
  Bottom 0.102: v24.87,18.34 25.38,18.34 26.52,17.2 26.52,16.03 25.81,15.32 25.81,15.19 22.68,12.06 22.68,9.35 21.08,7.75 v20.6,7.75
DTR_BUS2_AIN0/GPIO2  (via drill 0.15)
  Top 0.102: v17.7,20.57 17.7,21.31 18.77,22.38 18.77,22.45 U101.PC02 | v15.82,7.67 15.82,5.74 16.46,5.11 18.26,5.11 18.95,5.79 18.95,6.3 J301.15
  Bottom 0.102: v17.7,20.57 16.69,20.57 16.26,20.14 16.26,16.97 16.13,16.84 16.13,7.98 v15.82,7.67
DTR_BUS2_AIN1/GPIO3  (via drill 0.15)
  Top 0.102: v19.68,18.97 20.02,19.3 20.02,20.3 20.34,20.62 20.34,21.92 20.17,22.1 19.86,22.1 19.76,22 19.28,22 U101.PC03 | v17.8,4.78 18.34,4.78 19.36,5.79 J301.17
  Bottom 0.102: v19.68,18.97 18.8,18.97 18.44,19.33 18.09,19.33 16.89,18.14 16.89,5.69 v17.8,4.78
DTR_BUS2_GPIO0  (via drill 0.15)
  Top 0.102: v23.04,17.83 23.32,17.83 23.67,17.48 U101.PC13 | v21.11,7.42 21.11,7.04 21.34,6.81 21.34,6.33 J301.27
  Route2 0.102: v23.04,17.83 21.08,15.88 21.08,8.41 21.26,8.23 21.26,7.57 v21.11,7.42
DTR_BUS2_GPIO1  (via drill 0.15)
  Top 0.102: v23.6,12.5 23.6,15.21 23.77,15.39 U101.PC14 | v21.51,7.16 21.51,7.04 21.74,6.81 21.74,6.33 J301.29
  Bottom 0.102: v23.6,12.5 23.6,9.14 22.07,7.62 22.07,7.59 21.64,7.16 v21.51,7.16
DTR_BUS2_SERCOM2_P0
  Top 0.102: U101.PA12 24.26,16.97 24.26,16.76 24.13,16.64 24.13,15.34 24.26,15.21 24.26,11.15 22.55,9.45 J301.34
DTR_BUS2_SERCOM2_P1  (via drill 0.15)
  Top 0.102: v24.36,17.88 24.77,17.48 U101.PA13 | v23.93,15.06 23.93,11.2 22.17,9.45 22.17,8.94 J301.32
  Bottom 0.102: v24.36,17.88 24.36,16.87 23.93,16.43 v23.93,15.06
DTR_BUS2_SERCOM2_P2  (via drill 0.15)
  Top 0.102: v24.79,13.21 U101.PA14 | v22.15,10.57 21.29,10.57 20.17,9.45 J301.22
  Route2 0.102: v22.15,10.57 v24.79,13.21
DTR_BUS2_SERCOM2_P3  (via drill 0.15)
  Top 0.102: v25.27,15.75 U101.PA15 | v20.75,10.74 20.75,10.44 19.76,9.45 J301.20
  Bottom 0.102: v25.27,15.75 25.27,15.27 v20.75,10.74
DTR_DETECT/DTR_IRQ0/SERCOM7_P2
  Top 0.102: U101.PD10 21.77,16.97 21.77,14.43 18.97,11.63 18.97,8.94 J301.16
DTR_DTR0_V_SENSE
  Top 0.102: U3.D3 11.96,16 11.96,15.04 17.35,9.65 17.35,8.94 J301.8
DTR_IRQ1/SERCOM7_P3  (via drill 0.15)
  Top 0.102: v22.35,17.88 22.76,17.48 U101.PD11 | v22.15,16.36 22.15,12.62 19.38,9.86 19.38,8.94 J301.18
  Bottom 0.102: v22.35,17.88 22.35,16.56 v22.15,16.36
DTR_MSTR_GPIO0  (via drill 0.15)
  Top 0.102: v23.85,17.88 24.26,17.48 U101.PC15 | v26.54,14.96 26.54,8.53 25.04,7.04 24.38,7.04 24.16,6.81 24.16,6.33 J301.41
  Route2 0.102: v23.85,17.88 23.85,17.65 v26.54,14.96
DTR_MSTR_I2C_SCL_SERCOM7_P1  (via drill 0.15, 0.2)
  Top 0.102: v8.61,27.33 9.47,27.33 11.71,25.09 12.47,25.09 U203.6 12.32,25.07 v12.32,23.44 | v21.87,17.88 U101.PD09 | v20.45,13.59 20.45,13.41 18.57,11.53 J301.14
  Top 0.127: R103.1 37.06,12.73 SCL.TP 37.06,9.8 27.74,0.48 v6.17,0.48
  Route15 0.102: 8.97,27.33 v8.61,27.33
  Route15 0.127: v8.4,38.83 8.3,38.73 8.26,38.73 9.08,37.91 9.08,35.15 8.97,35.04 8.97,27.33 8.97,12.74 9.1,12.6 9.1,12.28 5.71,8.89 5.71,0.94 v6.17,0.48
  Bottom 0.102: v20.45,13.59 20.45,15.14 21.87,16.56 v21.87,17.88 21.84,17.78 18.72,20.9 14.86,20.9 v12.32,23.44
  Bottom 0.127: v8.4,38.83 8.84,38.39 U201.B1
DTR_MSTR_I2C_SDA_SERCOM7_P0  (via drill 0.15, 0.2)
  Top 0.102: v13.28,24.03 14.17,24.03 15.21,25.07 15.39,25.07 U203.1 | U101.PD08 21.26,16.97 21.26,15.24 18.16,12.14 J301.12 18.16,8.89 v18.16,7.16 | v18.16,1.55 18.16,0.71
  Top 0.127: R104.1 35.87,10.92 SDA.TP 35.51,8.74 27.48,0.71 18.16,0.71 6.9,0.71 v6.6,1.02
  Route15 0.102: v13.28,24.03 13.16,23.9 13.16,23.8 10.26,20.9 9.89,20.9
  Route15 0.127: v6.6,1.02 5.98,1.64 5.98,8.83 9.33,12.19 9.33,12.69 9.2,12.83 9.2,20.11 9.89,20.8 9.89,20.9 9.89,21.11 9.2,21.8 9.2,34.89 10.1,35.79 10.1,38.55 v9.8,38.84
  Bottom 0.102: v18.16,7.16 v18.16,1.55
  Bottom 0.127: U201.C1 9.27,38.22 9.27,38.3 v9.8,38.84
DTR_MSTR_SPI_CSS0_SERCOM3_P2  (via drill 0.15)
  Top 0.102: v26.19,19.56 U101.PD20 | v24.43,7.87 23.37,6.81 23.37,6.33 J301.37
  Bottom 0.102: v26.19,19.56 27.25,18.49 27.25,16.15 26.21,15.11 26.21,11.05 24.43,9.27 v24.43,7.87
DTR_MSTR_SPI_CSS1  (via drill 0.15)
  Top 0.102: v22.48,16.03 22.48,16.51 22.3,16.69 22.3,16.97 U101.PD12 | v21.87,4.78 22.91,4.78 23.09,4.95 23.09,5.26 22.78,5.56 22.4,5.56 22.17,5.79 22.17,6.3 J301.31
  Bottom 0.102: v22.48,16.03 22.48,14.76 19.07,11.35 19.07,7.57 v21.87,4.78
DTR_MSTR_SPI_MISO_SERCOM3_P3  (via drill 0.15)
  Top 0.102: v24.94,20.22 25.2,20.47 U101.PD21 | v28.65,20.22 28.65,17.25 26.85,15.44 26.85,15.14 26.87,15.11 26.87,6.53 25.91,5.56 24,5.56 23.77,5.79 23.77,6.3 J301.39
  Bottom 0.102: v28.65,20.22 v24.94,20.22
DTR_MSTR_SPI_MOSI_SERCOM3_P0  (via drill 0.15)
  Top 0.102: v24.87,19.56 U101.PC23 | v23.24,8.08 23.24,7.49 22.55,6.81 22.55,6.33 J301.33
  Route2 0.102: v24.87,19.56 24.87,18.85 26.85,16.87 26.85,15.14 26.87,15.11 26.87,11.71 v23.24,8.08
DTR_MSTR_SPI_SCK_SERCOM3_P1  (via drill 0.15)
  Top 0.102: v26.19,19.05 25.78,19.46 U101.PC22 | v23.8,7.82 23.8,7.64 22.96,6.81 22.96,6.33 J301.35
  Bottom 0.102: v26.19,19.05 26.19,18.26 26.72,17.73 26.72,15.93 26.01,15.21 26.01,12.04 23.8,9.83 v23.8,7.82
DTR_SENSE_SW  (via drill 0.15)
  Top 0.102: v19.68,17.88 U101.PC07 | v18.36,17.88 13.69,17.88 12.95,17.14 U3.B1 12.95,16.97 12.95,16.03 U3.B3
  Bottom 0.102: v18.36,17.88 v19.68,17.88
EN_STOR  (via drill 0.15)
  Top 0.102: v13.44,14.68 16.2,17.45 18.77,17.45 U101.PC06 | v8.33,9.58 8.26,9.58 7.77,9.09 U204.C2
  Route2 0.102: v8.33,9.58 v13.44,14.68
EN_TEMP  (via drill 0.15)
  Top 0.102: v14.61,29.41 19.25,24.77 19.25,23.98 U101.PB02
  Bottom 0.102: v14.61,29.41 14.5,29.41 14.07,29.84 U205.C2
GND  (via drill 0.15, 0.2)
  Top 0.102: S101.2_2 0.96,6.81 v1.93,7.77 1.91,7.8 1.91,8.23 1.55,8.59 1.55,9.75 0.96,10.34 S101.2_1 1.8,11.25 3,11.25 3.81,10.44 5.23,10.44 5.44,10.64 5.44,12.12 | J101.5 4.04,14.45 4.88,13.61 4.88,12.68 5.44,12.12 | C119.2 C118.2 12.93,22.45 12.32,22.45 | 12.32,22.45 9.32,22.45 9.2,22.58 | 9.2,22.58 7.26,24.51 J201.2 | 5.44,12.12 5.46,12.14 5.89,12.14 9.02,15.27 9.02,17.73 9.88,18.59 9.88,20.09 9.17,20.8 9.17,22.55 9.2,22.58 | J301.5 16.94,6.3 16.59,6.3 J301.3 16.54,6.3 16.18,6.3 J301.1 16.15,6.35 16.15,7.82 15.34,8.64 v11.43,8.64 9.6,8.64 9.09,9.14 C206.2 8.28,9.17 7.9,8.79 7.59,8.79 7.32,9.07 U204.C1 7.26,9.09 6.1,9.09 C208.2 | v13.89,16.51 U3.A2 | 11.53,31.65 v8.56,31.65 8.53,31.67 8.53,33.88 7.7,34.72 7.7,35.03 7.98,35.31 v8.71,35.31 | 11.53,31.65 12.85,32.97 C202.2 | v9.86,42.32 R1.1 | v15.82,26.59 15.42,26.19 15.42,26.09 U203.2 | U101.GNDIO0 19.28,22.45 20.3,22.45 21.23,21.51 U101.GNDIO7 | v33.66,22.96 32.94,22.96 C102.2 32.92,22.94 32.41,22.43 32.41,20.42 32.89,19.94 C109.2 32.92,19.89 33.66,19.89 | C115.2 37.01,32.84 37.01,29.62 37.74,28.88 37.74,23.34 36.47,22.07 C110.2 37.31,21.18 37.31,19.63 36.91,19.23 C108.2 36.85,18.77 36.4,18.31 35.64,18.31 34.06,19.89 33.66,19.89 | v33.66,19.91 33.66,19.89 | v12.88,29.84 11.56,31.17 11.56,31.62 11.53,31.65 | v12.32,22.48 12.32,22.45
  Top 0.127: 21.63,20.82 U101.GNDANA0 U101.GNDIO1 21.28,19.88 20.99,19.59 v20.99,19.17 v20.98,19.16 | 21.63,20.82 | 21.63,20.82 21.63,20.95 | 21.63,20.95 21.63,21.12 U101.GNDIO7 | 21.63,20.95 21.84,20.74 22.17,20.74 22.44,21.01 22.44,21.21 22.7,21.47 U101.GNDIO6 U101.GNDIO5 | U101.GNDIO5 | U101.GNDIO5 23.28,20.88 22.99,20.59 22.99,20.35 23.28,20.06 U101.GNDIO4 U101.GNDIO3 U101.GNDIO2
  Top 0.254: U101.GNDIO3
  Bottom 0.102: v1.93,7.77 2.85,7.77 3.58,8.51 4.17,8.51 C101.2 | 11.4,8.64 11.4,8.23 U2.9 | 11.4,8.64 11.4,10.06 U2.4 13.11,11.79 13.11,16.48 C1.2 v13.89,16.51 13.92,16.54 13.92,17.14 14.02,17.25 14.02,21.26 12.56,22.72 | v11.43,8.64 11.4,8.64 | 6.76,38.15 5.89,37.29 C203.2 6.07,37.41 6.07,35.41 4.52,33.86 4.52,32.36 C205.2 | 6.76,38.15 6.88,38.28 U4.C1 | 9.09,34.37 9.2,34.37 10.64,35.81 C204.2 10.62,35.87 10.62,36.2 9.4,37.41 9.4,37.44 | 6.76,38.15 8.64,36.27 8.64,35.41 v8.71,35.31 | 9.4,37.44 9.88,37.44 10.46,38.02 U1.2 | 9.4,37.44 9.25,37.44 U201.C3 | U1.2 10.49,38.05 U1.3 10.44,38.99 9.6,39.83 | v9.86,42.32 9.86,40.13 9.6,39.88 9.6,39.83 | 9.6,39.83 C201.2 | C2.2 7.85,39.83 7.95,39.93 9.5,39.93 9.6,39.83 | v16.2,43.26 16.18,43.1 16.18,42.72 11.84,38.38 U1.7 11.81,38.05 10.54,38.05 U1.2 | C103.2 21.54,32.26 20.42,33.38 C107.2 20.4,33.35 15.85,28.8 15.82,28.8 | C209.2 12.34,29.84 v12.88,29.84 13.56,29.84 U205.C1 13.61,29.87 13.89,30.15 14.2,30.15 14.61,29.74 C207.2 15.27,29.69 15.82,29.13 15.82,28.8 | 15.82,28.8 v15.82,26.59 15.85,26.57 15.85,24.36 | C114.2 31.83,22.96 33.02,22.96 C104.2 33.05,22.96 v33.66,22.96 | v33.66,19.91 33.05,19.91 C106.2 31.8,19.91 C112.2 31.77,19.89 24.69,19.89 24.28,19.48 23.21,19.48 C111.2 | 15.85,24.36 15.85,22.48 17.22,21.11 19.33,21.11 20.12,20.32 20.18,20.32 | 12.56,22.72 11.99,23.29 11.99,23.6 12.75,24.36 15.85,24.36 | 12.56,22.72 v12.32,22.48
  Bottom 0.127: C111.2 C105.2 21.69,19.16 v20.98,19.16 20.98,19.37 20.18,20.18 20.18,20.32 20.18,20.9 C113.2
  Bottom 0.254: U202.A4 9.09,33.94 9.09,34.37 9.09,35.31 v8.71,35.31 | v8.56,31.65 8.71,31.8 U202.B1 U202.B2 | J302.7 J302.5 J302.3 J302.1 16.23,43.23 v16.2,43.26
  other vias: 31.11,10.79 31.11,6.99 33.66,10.79 28.57,10.79 28.57,6.99 28.57,3.81 26.04,3.81 23.5,3.81 20.95,3.81 17.78,3.81 15.24,3.81 9.53,3.81 8.26,1.91 12.06,1.91 15.24,1.91 20.95,1.91 23.5,1.91 26.04,1.91 31.11,0.64 36.83,6.99 36.47,11.81 33.66,13.97 31.11,13.97 28.57,13.97 31.11,17.14 33.66,17.14 31.11,20.32 31.11,23.5 31.11,26.04 31.11,28.57 31.11,31.75 31.11,34.92 31.11,38.1 28.57,38.1 28.57,34.92 28.57,31.75 28.57,28.57 28.57,26.04 28.57,23.5 33.66,28.57 33.66,31.75 33.66,34.92 33.66,38.1 36.83,38.1 27.94,45.72 19.68,45.72 15.88,45.72 12.06,45.72 8.26,45.72 15.88,42.55 15.88,38.1 15.88,34.92 15.88,31.75 12.7,31.75 2.54,30.48 1.27,30.48 1.27,35.56 28.57,41.27 19.05,36.2 19.05,33.66 19.05,31.11 16.51,25.4 10.16,25.4 10.16,23.5 8.26,22.86 6.99,22.86 5.71,22.86 3.81,23.5 3.81,24.77 3.81,26.04 3.81,27.3 1.91,26.04 1.91,23.5 6.99,20.95 1.27,20.95 1.91,13.34 7.62,13.34 6.48,7.52 13.34,7.62 13.34,5.71 15.24,10.79 13.97,12.06 26.31,7.26 22.2,11.38 20.32,11.99 18.41,13.13 15.24,13.77 15.42,16.05 14.61,18.41 22.12,18.36 24.03,18.52 21.64,22.1 19.05,26.04 24.21,41.86 26.24,42.27 17.6,41.68 8.53,41.63 17.37,16.61 24.94,12.12 34.29,24.77
  pour Route2: -3.17,50.16 -3.17,-3.17 41.4,-3.17 41.4,50.16
  pour Bottom: -5.71,52.7 -5.71,-5.71 43.94,-5.71 43.94,52.7
  pour Top: -1.91,48.9 -1.91,-1.91 40.13,-1.91 40.13,48.9
  pour Route15: -4.45,-4.45 -4.45,51.44 42.55,51.44 42.55,-4.45
JTAG_NRESET  (via drill 0.15)
  Top 0.102: v4.6,14.48 4.6,15.67 J101.3
  Bottom 0.102: v4.6,14.48 4.6,13.49 3.33,12.22 3.33,11.02 R105.2
LDO_REG_OUT  (via drill 0.2)
  Top 0.254: REG.IN.3 8.18,36.2 13.34,36.2 13.97,36.83 v13.97,37.47
  Bottom 0.254: v13.97,37.47 13.41,38.02 U1.5 U1.4
LED_B  (via drill 0.15)
  Top 0.102: v24.94,20.73 25.17,20.95 25.27,20.95 U101.PB18 | v29.31,20.73 29.84,20.73 32.54,23.42 34.85,23.42 34.9,23.37 35.97,23.37 R202.2
  Bottom 0.102: v29.31,20.73 v24.94,20.73
LED_G  (via drill 0.15)
  Top 0.102: v26.64,21.79 26.34,21.49 25.78,21.49 U101.PB19 | v29.67,21.79 30.61,21.79 32.59,23.77 R203.2
  Bottom 0.102: v29.67,21.79 v26.64,21.79
LED_R  (via drill 0.15)
  Top 0.102: v24.41,20.68 25.2,21.46 U101.PB20 | v26.36,23.09 31.39,23.09 R204.2
  Route15 0.102: v24.41,20.68 24.46,20.73 24.46,22.84 24.54,22.91 24.54,23.14 24.71,23.32 26.31,23.32 26.31,23.14 v26.36,23.09
LED_VIN
  Top 0.254: JP202.1 36.62,28.33 D202.4
N$2
  Top 0.254: JP203.3 7.01,40.62 | 7.01,40.62 7.04,40.64 U5.2 | Q1.2 7.66,44.21 7.64,44.21 7.01,43.58 7.01,40.62
N$4
  Top 0.102: R202.1 36.4,25.86 36.6,26.06 D202.3
N$5  (via drill 0.15)
  Top 0.102: v1.88,9.4 1.88,9.86 2.39,10.36 S101.1_1 2.16,10.08 3.35,8.89 3.35,8.28 2.41,7.34 2.41,6.81 S101.1_2
  Bottom 0.102: v1.88,9.4 1.22,10.06 1.22,11.05 R102.2
N$12
  Top 0.102: R203.1 35.2,25.65 D202.1
N$13  (via drill 0.2)
  Top 0.127: v9.73,38 8.56,36.83 6.99,36.83 v6.68,36.52
  Bottom 0.127: U201.C2 9.55,37.82 v9.73,38 | v6.68,36.52 6.68,37.19 C203.1
N$14
  Top 0.102: R204.1 35.28,27.13 35.61,27.46 D202.2
N$17  (via drill 0.2)
  Top 0.254: DTR.SW.1 v11.43,16.74 11.68,16.74 11.79,16.63 11.83,16.63 U3.D2
  Bottom 0.254: v11.43,16.74 11.66,16.51 C1.1
NRESET  (via drill 0.15)
  Top 0.102: v21.21,34.8 22.17,33.83 22.17,27.2 22.12,27.15 22.12,24.23 22.28,24.08 U101.NRESET
  Route2 0.102: v14.68,28.19 21.21,34.72 v21.21,34.8
  Bottom 0.102: 4.22,10.62 4.22,9.98 R101.1 4.32,9.91 4.65,9.58 4.65,8.13 4.17,7.64 C101.1 | 4.22,10.62 R105.1 4.24,11.05 4.8,11.05 10.52,16.76 10.52,24.03 v14.68,28.19 | R102.1 2.56,11.05 3,10.62 4.22,10.62 | v21.21,34.8 21.21,40.59 J302.24
REG_LDO_IN  (via drill 0.2)
  Top 0.254: v12.62,35.74 12.62,34.57 REG.OUT.3
  Bottom 0.254: U1.6 12.96,36.85 12.96,36.63 12.62,36.29 | 12.62,36.29 v12.62,35.74 | 12.62,36.29 12.42,36.49 10.84,36.49 10.71,36.63 10.71,36.85 U1.1
STOR_QSPI_CK  (via drill 0.15)
  Top 0.102: v15.01,12.5 15.21,12.5 19.68,16.97 19.76,16.97 U101.PB10
  Route15 0.102: v15.01,12.5 14.4,11.89 14.4,10.95 11.51,8.05 v11.51,4.17
  Bottom 0.102: v11.51,4.17 11.51,3.99 10.16,2.64 U2.6
STOR_QSPI_CS  (via drill 0.15, 0.2)
  Top 0.102: v20.8,17.88 20.78,17.86 U101.PB11
  Top 0.127: v6.94,8.26 6.94,8.12 R3.2
  Route2 0.102: v20.8,17.88 20.62,17.88 18.24,15.49 13.13,15.49 12.83,15.19 v12.45,15.19
  Bottom 0.102: v12.45,15.19 12.45,15.01 7.62,10.19 U2.1
  Bottom 0.127: U2.1 7.62,8.94 v6.94,8.26
STOR_QSPI_D0  (via drill 0.15)
  Top 0.102: v16.56,15.16 16.71,15.16 18.52,16.97 U101.PA08
  Bottom 0.102: v16.56,15.16 16.56,7.75 11.43,2.62 U2.5
STOR_QSPI_D1  (via drill 0.15)
  Top 0.102: v20.14,17.88 20.14,17.83 U101.PA09
  Route15 0.102: v20.14,17.88 20.02,17.75 20.02,17.73 19.41,17.12 14.22,17.12 14.22,16.31 v12.72,14.81
  Bottom 0.102: v12.72,14.81 12.72,13.95 U2.2
STOR_QSPI_D2  (via drill 0.15)
  Top 0.102: v14.1,14.83 17.04,14.83 19.18,16.97 19.25,16.97 U101.PA10
  Route15 0.102: v14.1,14.83 12.04,12.78 v12.04,12.09
  Bottom 0.102: v12.04,12.09 12.04,11.99 U2.3
STOR_QSPI_D3  (via drill 0.15)
  Top 0.102: v20.47,18.21 20.47,17.73 20.3,17.55 20.3,17.48 U101.PA11
  Route15 0.102: v15.93,18.21 v20.47,18.21
  Bottom 0.102: v15.93,18.21 15.93,12.93 11.96,8.97 11.96,4.14 10.59,2.77 10.59,2.03 10.49,1.93 9.55,1.93 U2.7
V.SRC  (via drill 0.2)
  Top 0.254: S201.3 4.24,38.1 | 4.24,38.1 4.24,38.5 v4.34,38.61 | 4.24,38.1 5.58,39.45 JP203.2
  Bottom 0.254: 6.07,38.79 U4.B2 U4.A2 | 6.07,38.79 5.91,38.79 | 5.91,38.79 5.21,38.79 C2.1 4.66,38.92 v4.34,38.61 | U4.A2 6.41,39.12 6.07,38.79 | U4.A2 5.91,38.79
V.SRC.EN  (via drill 0.2)
  Top 0.127: v5.71,35.56 4.99,34.84 S201.2
  Bottom 0.127: U4.C2 5.88,37.76 5.5,37.76 5.08,37.35 5.08,36.2 v5.71,35.56
V_SEL_IN_B  (via drill 0.2)
  Top 0.254: Q1.1 9.86,44.38 R1.2 11.18,43.81 11.3,43.69 | JP201.1 11.3,43.69 | U5.1 12.2,41.43 v12.65,41.43 | v11.43,44.86 11.43,43.81 11.3,43.69
  Bottom 0.254: v12.65,41.43 11.43,42.65 v11.43,44.86
VDDANA  (via drill 0.2)
  Top 0.254: C108.1 36.36,19.16 36.36,19.2 36.42,19.26 C110.1 34.82,20.28 L102.1 34.43,20.68 v33.73,20.68 | U101.VDDANA1 20.05,18.47 20.55,18.97 v20.55,20.32 20.62,20.32 21.13,20.83 | U101.VDDANA0 21.13,20.83 | 21.13,20.83
  Route2 0.254: v20.55,20.32 20.91,20.68 22.2,20.68 22.61,21.08 24.33,21.08 24.46,21.21 33.2,21.21 v33.73,20.68
  Bottom 0.254: C105.1 20.91,19.96 v20.55,20.32
VDDCORE  (via drill 0.2)
  Top 0.254: v21.82,27.36 21.82,24.02 U101.VDDCORE
  Bottom 0.254: C107.1 21.79,31.59 C103.1 | C103.1 22.38,31.71 22.43,31.71 22.63,31.92 22.63,33.66 CPU.TP | C103.1 22.02,29.33 L101.P$2 21.82,28.99 v21.82,27.36
VREG_BB_IN  (via drill 0.2)
  Top 0.254: v10.16,33.3 10.95,34.09 REG.OUT.1 10.92,34.49 9.35,34.49 9.04,34.8 8.13,34.8 v8.05,34.87
  Bottom 0.254: v10.16,33.3 9.98,33.12 U202.A2 | v8.05,34.87 8.31,34.61 U202.C4
VREG_BIAS
  Bottom 0.254: U202.A3 9.23,33.52 C204.1
VREG_IN  (via drill 0.2)
  Top 0.254: C202.1 11.27,33.56 11.49,33.79 11.49,34.25 REG.OUT.2 11.49,34.78 11.49,35.25 11.36,35.38 9.88,35.38 v9.53,35.74
  Bottom 0.254: U201.B3 8.89,37.37 8.89,37.28 9.53,36.64 v9.53,35.74
VSW  (via drill 0.2)
  Top 0.254: U101.VSW 21.28,24.38 21.46,24.56 21.46,26.87 21.11,27.23 v21.11,27.25
  Bottom 0.254: v21.11,27.25 19.55,28.81 L101.P$1
XIN32
  Top 0.254: C118.1 14.36,23.31 Y102.1 15.67,23.97 U101.PA00
XOUT32
  Top 0.254: C119.1 14.54,20.35 Y102.2 15.88,21.69 15.88,22.86 16.49,23.47 U101.PA01

## Text on the board
Document: Screw holes at 115 mil for M2.5 screws / of ~94 mil diameter. / Estimate 200mil diameter for / standoffs/spacers, within which / vias should be avoided to prevent / unexpected connections between / boards if metal spacers are used.